# EAGLE design sample-holder-pcb (EAGLE 9.5.2)
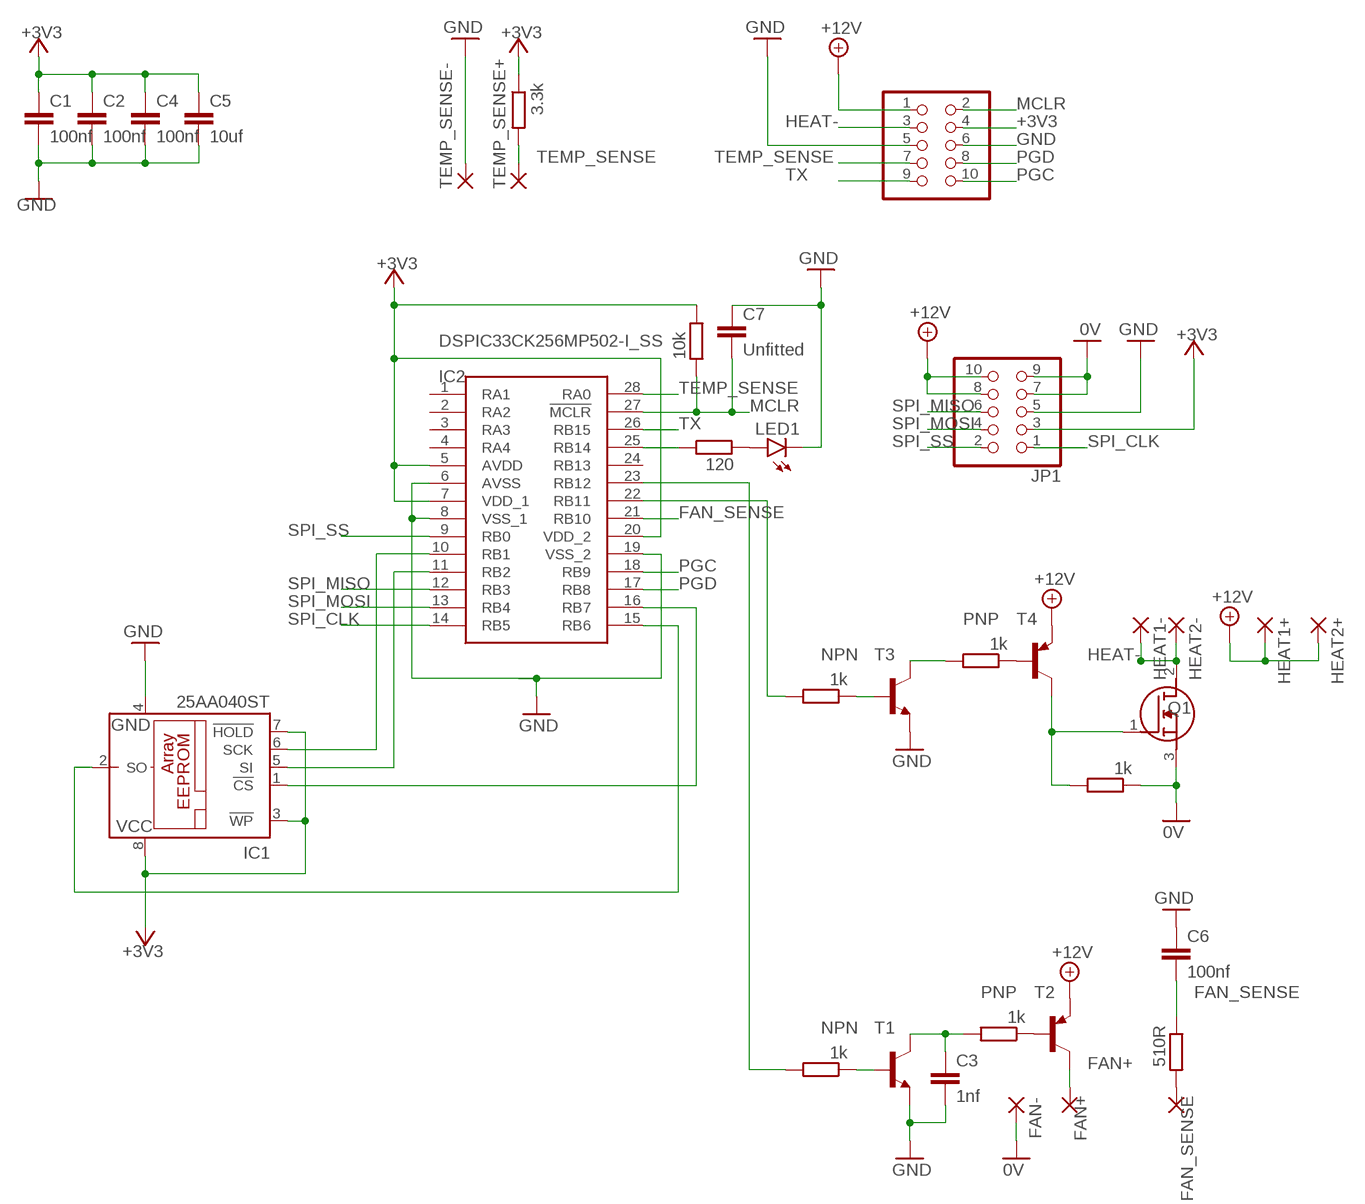
[diagram p0: schematic, sheet 1]

## Parts
C1  100nf  C-EUC0603  [C0603]
C2  100nf  C-EUC0603  [C0603]
C3  1nf  C-EUC0603  [C0603]
C4  100nf  C-EUC0603  [C0603]
C5  10uf  C-EUC1206  [C1206]
C6  100nf  C-EUC0603  [C0603]
C7  Unfitted  C-EUC0603  [C0603]
FAN+  1,6/0,8  [1,6/0,8]
FAN-  1,6/0,8  [1,6/0,8]
FAN_SENSE  1,6/0,8  [1,6/0,8]
HEAT1+  2,54/1,0  [2,54/1,0]
HEAT1-  2,54/1,0  [2,54/1,0]
HEAT2+  2,54/1,0  [2,54/1,0]
HEAT2-  2,54/1,0  [2,54/1,0]
IC1  25AA040ST  [TSSOP8]
IC2  DSPIC33CK256MP502-I_SS  [SOP65P780X200-28N]
JP1  PINHD-2X5/90  [2X05/90]
JP2  PINHD-2X5/90  [2X05/90]
LED1  LEDSML0603  [SML0603]
Q1  AUIRFU8403  [TO229P239X654X978-3P]
R1  1k  R-EU_R0603  [R0603]
R2  1k  R-EU_R0603  [R0603]
R3  1k  R-EU_R0603  [R0603]
R4  1k  R-EU_R0603  [R0603]
R5  1k  R-EU_R0603  [R0603]
R6  510R  R-EU_R0603  [R0603]
R7  3.3k  R-EU_R0603  [R0603]
R8  120  R-EU_R0603  [R0603]
R9  10k  R-EU_R0603  [R0603]
T1  NPN  MMBT3904LT1-NPN-SOT23-BEC  [SOT23-BEC]
T2  PNP  MMBT3906LT1-PNP-SOT23-BEC  [SOT23-BEC]
T3  NPN  MMBT3904LT1-NPN-SOT23-BEC  [SOT23-BEC]
T4  PNP  MMBT3906LT1-PNP-SOT23-BEC  [SOT23-BEC]
TEMP_SENSE+  1,6/0,8  [1,6/0,8]
TEMP_SENSE-  1,6/0,8  [1,6/0,8]

## Nets
0V: FAN-.1(P) JP1.7 JP1.9 Q1.3(S) R5.1
+3V3: C1.1 C2.1 C4.1 C5.1 IC1.3(!WP) IC1.7(!HOLD) IC1.8(VCC) IC2.5(AVDD) IC2.7(VDD_1) IC2.20(VDD_2) JP1.3 JP2.4 R7.1 R9.1
+12V: HEAT1+.1(P) HEAT2+.1(P) JP1.8 JP1.10 JP2.1 T2.E T4.E
FAN+: FAN+.1(P) T2.C
FAN_SENSE: C6.2 IC2.21(RB10) R6.1
GND: C1.2 C2.2 C3.2 C4.2 C5.2 C6.1 C7.1 IC1.4(GND) IC2.6(AVSS) IC2.8(VSS_1) IC2.19(VSS_2) JP1.5 JP2.5 JP2.6 LED1.C T1.E T3.E TEMP_SENSE-.1(P)
HEAT-: HEAT1-.1(P) HEAT2-.1(P) JP2.3 Q1.2(D)
MCLR: C7.2 IC2.27(!MCLR) JP2.2 R9.2
N$1: R2.1 T3.B
N$2: R4.2 T3.C
N$3: R4.1 T4.B
N$4: Q1.1(G) R5.2 T4.C
N$5: FAN_SENSE.1(P) R6.2
N$6: LED1.A R8.2
N$7: IC2.25(RB14) R8.1
N$9: R1.1 T1.B
N$10: C3.1 R3.2 T1.C
N$11: R3.1 T2.B
N$12: IC2.22(RB11) R2.2
N$13: IC1.5(SI) IC2.11(RB2)
N$14: IC1.6(SCK) IC2.10(RB1)
N$15: IC1.2(SO) IC2.15(RB6)
N$16: IC1.1(!CS) IC2.16(RB7)
N$17: IC2.23(RB12) R1.2
PGC: IC2.18(RB9) JP2.10
PGD: IC2.17(RB8) JP2.8
SPI_CLK: IC2.14(RB5) JP1.1
SPI_MISO: IC2.12(RB3) JP1.6
SPI_MOSI: IC2.13(RB4) JP1.4
SPI_SS: IC2.9(RB0) JP1.2
TEMP_SENSE: IC2.28(RA0) JP2.7 R7.2 TEMP_SENSE+.1(P)
TX: IC2.26(RB15) JP2.9
Unconnected: IC2.1(RA1) IC2.2(RA2) IC2.3(RA3) IC2.4(RA4) IC2.24(RB13)

## Library data of the parts
C1-C7 = rcl:C-EU: CAPACITOR, European symbol; SPICEPREFIX: C
FAN+ FAN- FAN_SENSE TEMP_SENSE+ TEMP_SENSE- = wirepad:1,6/0,8: THROUGH-HOLE PAD
HEAT1+ HEAT1- HEAT2+ HEAT2- = wirepad:2,54/1,0: THROUGH-HOLE PAD
IC1 = microchip:25*: Serial EEPROM 4K/ 8K , SPI bus; MPN: 25AA040A-I/MS; OC_FARNELL: 1331345; OC_NEWARK: 35M0801
IC2 = dsPIC33CK256MP502-I_SS:DSPIC33CK256MP502-I_SS: Digital Signal Processors & Controllers - DSP, DSC 16 Bit DSC, 256KB Flash, 24KB RAM, 100MHz, 28Pin, 3 OpAmp, 3 Comp, PTG, CAN-FD Source: Datasheet <http://uk.rs-online.com/web/p/products/1793987P>; DESCRIPTION: Digital Signal Processors & Controllers - DSP, DSC 16 Bit DSC, 256KB Flash, 24KB RAM, 100MHz, 28Pin, 3 OpAmp, 3 Comp, PTG, CAN-FD; HEIGHT: 2mm; MANUFACTURER_NAME: Microchip; MANUFACTURER_PART_NUMBER: dsPIC33CK256MP502-I/SS; RS_PART_NUMBER: 1793987P; RS_PRICE-STOCK: http://uk.rs-online.com/web/p/products/1793987P
JP1 JP2 = pinhead:PINHD-2X5: PIN HEADER
LED1 = led:LED: LED OSRAM: - CHIPLED LG R971, LG N971, LY N971, LG Q971, LY Q971, LO R971, LY R971 LH N974, LH R974 LS Q976, LO Q976, LY Q976 LO Q996 - Hyper CHIPLED LW Q18S LB Q993, LB Q99A, LB R99A - SideLED LS A670, LO A670, LY A670, LG A670, LP A670 LB A673, LV A673, LT A673, LW A673 LH A674 LY A675 LS A676, LA A676, LO A676, LY A676, LW A676 LS A679, LY A679, LG A679 - Hyper Micro SIDELED® LS Y876, LA Y876, LO Y876, LY Y876 LT Y87S - SmartLED LW L88C, LW L88S LB L89C, LB L89S, LG L890 LS L89K, LO L89K, LY L89K LS L896, LA L896, LO L896, LY L896 - TOPLED LS T670, LO T670, LY T670, LG T670, LP T670 LSG T670, LSP T670, LSY T670, LOP T670, LYG T670 LG T671, LOG T671, LSG T671 LB T673, LV T673, LT T673, LW T673 LH T674 LS T676, LA T676, LO T676, LY T676, LB T676, LH T676, LSB T676, LW T676 LB T67C, LV T67C, LT T67C, LS T67K, LO T67K, LY T67K, LW E67C LS E67B, LA E67B, LO E67B, LY E67B, LB E67C, LV E67C, LT E67C LW T67C LS T679, LY T679, LG T679 LS T770, LO T770, LY T770, LG T770, LP T770 LB T773, LV T773, LT T773, LW T773 LH T774 LS E675, LA E675, LY E675, LS T675 LS T776, LA T776, LO T776, LY T776, LB T776 LHGB T686 LT T68C, LB T68C - Hyper Mini TOPLED® LB M676 - Mini TOPLED Santana® LG M470 LS M47K, LO M47K, LY M47K Source: http://www.osram.convergy.de LUXEON: - LUMILED® LXK2-PW12-R00, LXK2-PW12-S00, LXK2-PW14-U00, LXK2-PW14-V00 LXK2-PM12-R00, LXK2-PM12-S00, LXK2-PM14-U00 LXK2-PE12-Q00, LXK2-PE12-R00, LXK2-PE12-S00, LXK2-PE14-T00, LXK2-PE14-U00 LXK2-PB12-K00, LXK2-PB12-L00, LXK2-PB12-M00, LXK2-PB14-N00, LXK2-PB14-P00, LXK2-PB14-Q00 LXK2-PR12-L00, LXK2-PR12-M00, LXK2-PR14-Q00, LXK2-PR14-R00 LXK2-PD12-Q00, LXK2-PD12-R00, LXK2-PD12-S00 LXK2-PH12-R00, LXK2-PH12-S00 LXK2-PL12-P00, LXK2-PL12-Q00, LXK2-PL12-R00 Source: www.luxeon.com KINGBRIGHT: KA-3528ASYC Source: www.kingbright.com
Q1 = AUIRFU8403:AUIRFU8403: Infineon AUIRFU8403 N-channel MOSFET, 100 A, 127 A, 40 V COOLiRFET, 3-Pin IPAK Source: Datasheet <http://uk.rs-online.com/web/p/products/7870991P>; DESCRIPTION: Infineon AUIRFU8403 N-channel MOSFET, 100 A, 127 A, 40 V COOLiRFET, 3-Pin IPAK; HEIGHT: 2.39mm; MANUFACTURER_NAME: Infineon; MANUFACTURER_PART_NUMBER: AUIRFU8403
R1-R9 = rcl:R-EU_: RESISTOR, European symbol; SPICEPREFIX: R
T1 T3 = transistor:*-NPN-: NPN Transistror BF959 corrected 2008.03.06
T2 T4 = transistor:*-PNP-: PNP Transistror

## Board
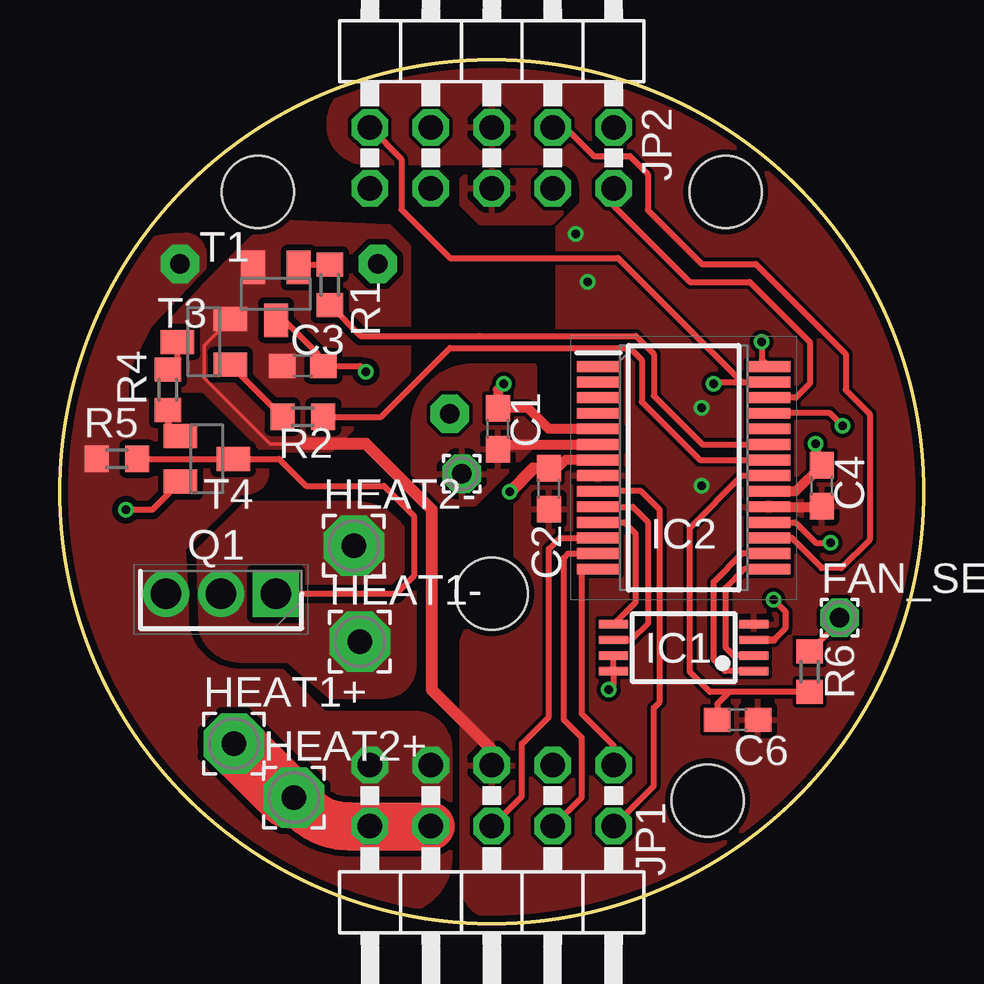
[diagram p1: board, top side]
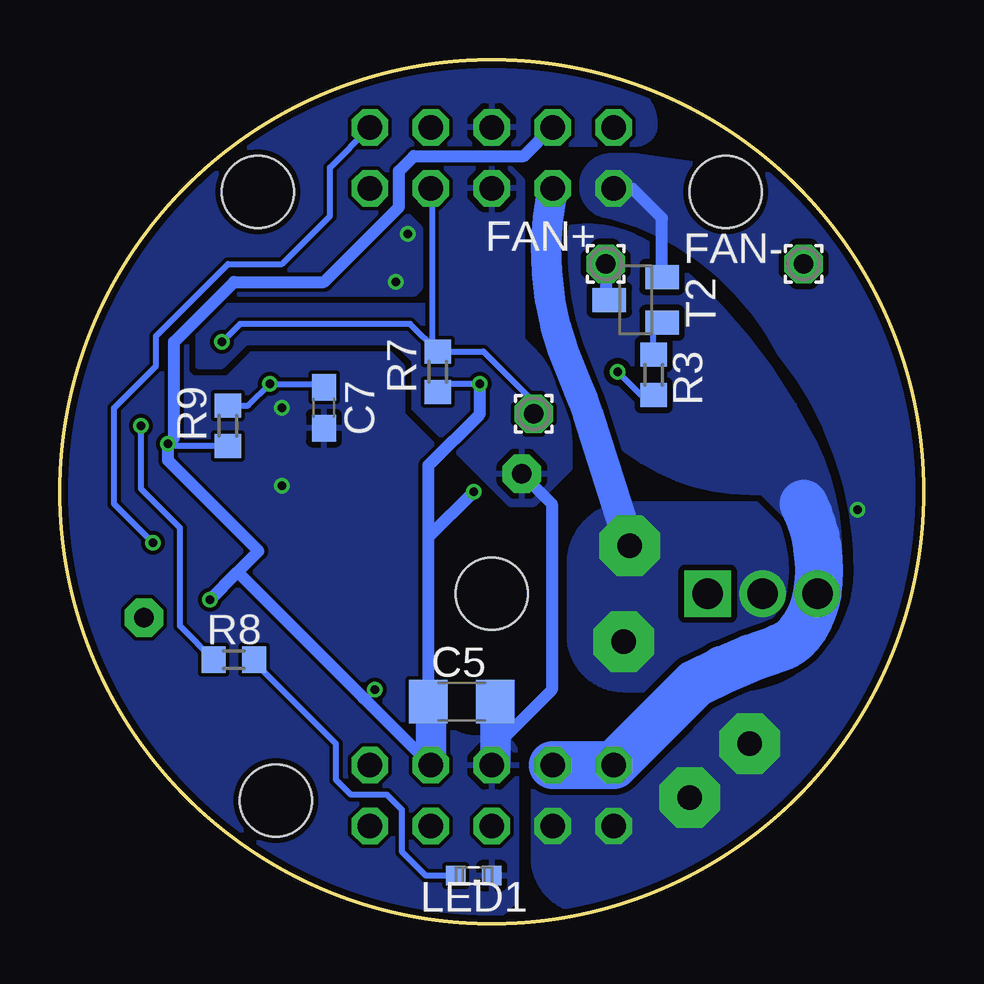
[diagram p2: board, bottom side, seen from below]

Size 36 x 36 mm. Coordinates in mm from the lower left corner, seen from the top.
Outline: circle at 18,18 radius 18
Copper layers (1*16): Top 0.035mm / dielectric 1.5mm / Bottom 0.035mm
Design rules "ITEADstudio_DRC": minimum track width 6mil, minimum drill 12mil, track to track 6mil, track to pad 6mil, pad to pad 6mil, via to via 6mil, smd to smd 0mil, copper to edge 10mil, drill to drill 10mil, minimum pad ring 10mil, minimum via ring 6mil, stop-mask expansion 2mil, vias tented up to drill 100mil, thermal gap 10mil
Holes 3 mm at 18,13.75 8.25,30.5 27.75,30.5 27,5.12

### Footprints (pad centres in the part's own frame; a part is rotated, then mirrored left to right if it is on the bottom)
C0603 = smd 1.1 x 1: 1 -0.85,0; 2 0.85,0
C1206 = smd 1.6 x 1.8: 1 -1.4,0; 2 1.4,0
1,6/0,8 = drill 0.813 pad 1.6 octagon: 1 0,0
2,54/1,0 = drill 1.016 pad 2.54 octagon: 1 0,0
TSSOP8 = smd 0.35 x 1.2: 1 -0.975,-2.925; 2 -0.325,-2.925; 3 0.325,-2.925; 4 0.975,-2.925; 5 0.975,2.925; 6 0.325,2.925; 7 -0.325,2.925; 8 -0.975,2.925
SOP65P780X200-28N = smd 1.8 x 0.45: 1 -3.55,4.225; 2 -3.55,3.575; 3 -3.55,2.925; 4 -3.55,2.275; 5 -3.55,1.625; 6 -3.55,0.975; 7 -3.55,0.325; 8 -3.55,-0.325; 9 -3.55,-0.975; 10 -3.55,-1.625; 11 -3.55,-2.275; 12 -3.55,-2.925; 13 -3.55,-3.575; 14 -3.55,-4.225; 15 3.55,-4.225; 16 3.55,-3.575; 17 3.55,-2.925; 18 3.55,-2.275; 19 3.55,-1.625; 20 3.55,-0.975; 21 3.55,-0.325; 22 3.55,0.325; 23 3.55,0.975; 24 3.55,1.625; 25 3.55,2.275; 26 3.55,2.925; 27 3.55,3.575; 28 3.55,4.225
2X05/90 = drill 1.016 octagon: 1 -5.08,-6.35; 2 -5.08,-3.81; 3 -2.54,-6.35; 4 -2.54,-3.81; 5 0,-6.35; 6 0,-3.81; 7 2.54,-6.35; 8 2.54,-3.81; 9 5.08,-6.35; 10 5.08,-3.81
SML0603 = smd 0.8 x 0.8: A 0.75,0; C -0.75,0
TO229P239X654X978-3P = drill 1.28 pad 1.92 square: 1 0,0 | drill 1.28 pad 1.92: 2 2.29,0; 3 4.58,0
R0603 = smd 1 x 1.1: 1 -0.85,0; 2 0.85,0
SOT23-BEC = smd 1 x 1.4: B -0.95,-1.1; C 0,1.1; E 0.95,-1.1

### Placement (x,y rotation side)
C1  18.25,20.62 270 top
C2  20.38,18.12 270 top
C3  10.12,23.25 180 top
C4  31.75,18.25 270 top
C5  19.25,9.25 0 bottom
C6  28.25,8.5 180 top
C7  25,21.5 90 bottom
FAN+  13.25,27.5 0 bottom
FAN-  5,27.5 0 bottom
FAN_SENSE  32.5,12.75 0 top
HEAT1+  7.25,7.5 0 top
HEAT1-  12.5,11.75 0 top
HEAT2+  9.75,5.25 0 top
HEAT2-  12.25,15.75 0 top
IC1  26,11.5 90 top
IC2  26,19 0 top
JP1  18,0.25 180 top
JP2  18,37 0 top
LED1  18.75,2 180 bottom
Q1  9,13.75 180 top
R1  11.25,26.62 270 top
R2  10.12,21.12 0 top
R3  11.25,22.88 270 bottom
R4  4.5,22.25 90 top
R5  2.38,19.38 0 top
R6  31.25,10.5 90 top
R7  20.25,23 90 bottom
R8  28.75,11 0 bottom
R9  29,20.75 90 bottom
T1  9,26.25 180 top
T2  12,26 90 bottom
T3  6,24.25 90 top
T4  6.12,19.38 270 top
TEMP_SENSE+  16.25,21.25 0 bottom
TEMP_SENSE-  16.75,18.75 0 top

### Tracks (layer width: path | path; a pad name or v marks a point on that pad's centre or on a via)
0V
  Bottom 2: JP1.7 JP1.9 9.51,10.01 arc10 6,11.5 arc-32 5.25,12 | 5,17.5 arc32 4.38,14.25 Q1.3 arc30 5.25,12 | 5.25,12 arc-7 4.88,12.5
  pour Top (isolate 0.254, no thermals): 5.25,12.75 5.25,13.5 arc90 3,15.75 arc90 0.88,13.62 arc90 14,0.5 arc90 16.25,2.75 16.25,7.25 arc90 14.75,8.75 11,8.75 9.25,10.5 7.5,10.5 arc-90
  pour Top (isolate 0.254, no thermals): 5.13,15.63 7.5,18 7.75,18 arc90 8.62,18.88 5.75,21.75 2.75,21.75 2.75,23 3.75,25 6,27.38 6,27.88 arc90 5.19,28.69 arc90 0,23.5 0,14.25 0.75,12.75 4.25,12.75 arc74 5.25,13.5
  pour Bottom (isolate 0.254): 15.06,28.94 arc-90 15.75,28.25 15.75,26.5 arc-90 7.25,18 6.75,18 4.25,15.5 3.5,15.5 arc-26 4.58,20.1 arc-25 11,28 arc-51
+3V3  (via drill 0.35)
  Top 0.254: IC1.7 IC1.8 23.08,9.95 v22.88,9.75 | 29.75,11.82 30.25,12.32 30.25,13 v29.75,13.5
  Top 0.305: IC1.3 29.75,11.82
  Top 0.406: IC2.7 21.08,19.33 20.73,18.98 C2.1 19.73,18.98 | IC2.5 20.38,20.62 19.5,21.5 18.27,21.5 C1.1 18.25,22.25 v18.5,22.5 | v31.5,20 31.5,19.35 C4.1 30.67,18.02 IC2.20
  Top 0.508: 19.73,18.98 v18.75,18
  Bottom 0.254: v22.88,9.75 23.22,9.41 23.34,9.41 | v18.5,22.5 19.9,22.5 R7.1 | R9.1 31.4,19.9 v31.5,20
  Bottom 0.508: JP1.3 23.34,9.41 28.59,14.66 | v29.75,13.5 28.59,14.66 | 28.59,14.66 27.72,15.53 31.5,19.31 v31.5,20 31.25,20.25 31.25,24.25 28.75,26.75 25,26.75 21.88,29.88 21.88,31.38 21.25,32 16.65,32 JP2.4 | v18.75,18 20.65,16.1 | 20.65,16.1 20.65,19.1 18.5,21.25 v18.5,22.5 | 20.65,16.1 C5.1 20.54,9.14
  Bottom 1.27: 20.54,9.14 JP1.3
+12V  (via drill 0.35)
  Top 0.254: T4.E 3.85,17.25 v2.75,17.25
  Top 2: HEAT2+.1 10.2,4.8 arc45 11.99,4.06 JP1.10 JP1.8
  Top 2.54: HEAT1+.1 9.5,5.25 HEAT2+.1
  Bottom 0.508: T2.E 10.9,29.4 12.15,30.65 JP2.1
  pour Bottom (isolate 0.254, no thermals): 16.25,2.75 16.25,6 arc90 13.25,9 4.75,9 arc90 3.5,7.75 arc90 10.75,0.5 14,0.5 arc90
  pour Bottom (isolate 0.254, no thermals): 4.25,6 arc-90 -0.5,10.75 -0.5,25.5 arc-90 5,31 12,32 13,32 arc-90 14.25,30.75 arc-90 13,29.5 arc47 6.02,23.82 arc39 2.8,14.7 arc90 8,9.5 arc-90 9.5,8 arc-90 7.5,6
FAN+
  Bottom 0.508: T2.C 13.25,26.15 FAN+.1
FAN_SENSE
  Top 0.254: R6.1 27.9,9.65 | C6.2 27.4,9.15 27.9,9.65 | 27.9,9.65 27.1,9.65 26.25,10.5 26.25,16.5 28.42,18.67 IC2.21
GND  (via drill 0.35)
  Top 0.152: 10.25,20 8.75,20 6,22.75 6,24.1 T3.E
  Top 0.406: IC2.6 18.45,19.98 C1.2 | IC2.19 31.73,17.38 C4.2
  Top 0.508: JP1.5 18,7.25 15.5,9.75 15.5,17.25 12.75,20 10.25,20
  Bottom 0.508: TEMP_SENSE-.1 15.5,17.5 15.5,9.75 18,7.25 JP1.5
  Bottom 1.27: JP1.5 17.85,6.75 C5.2
  other vias: 26.75,18.25 26.75,21.5 22,26.75 21.5,28.75
  pour Top (isolate 0.254, no thermals): 8.25,20 6,22.25 3.5,22.25 arc-44 4.67,25.17 arc-3 8.76,29.26 13.69,29.06 14.5,28.25 14.5,23 11.25,19.75 8.45,19.75
  pour Bottom: 21.25,21.5 17.25,17.5 16.25,17.5 14.75,19 14.75,20 arc-90 20.5,25.75 29,25.75 30.25,24.5 30.25,23.25 29.25,23.25 28.25,24.25 22,24.25 21.25,23.5
  pour Top: 19.75,20 17.25,17.5 16,17.5 14.75,18.75 14.75,20.75 arc-90 17.25,23.25 19.75,23.25
  pour Top: 31.25,5.5 34.34,8.59 arc116 15.4,37.39 12.59,35.12 arc74 11.21,33.29 arc90 12.75,31.75 20.75,31.75 arc-90 21.75,30.75 21.75,30 20.75,29 20.75,21.5 21,21.25 23,21.25 arc-90 23.75,20.5 23.75,20 arc-90 23,19.25 20.75,19.25 arc90 19,17.5 19,13.75 arc-90 18,12.75 arc90 16.75,11.5 16.75,1.75 arc90 18.25,0.25 arc44
  pour Bottom: 31.25,5.5 34.34,8.59 arc116 15.4,37.39 12.59,35.12 arc74 11.21,33.29 arc90 12,32.5 20.25,32.5 arc-90 22.25,30.5 21.75,29.75 21,29 21,26.5 21.25,26.25 29.25,26.25 30.75,24.75 30.75,23 30.5,22.75 29,22.75 28,23.75 22.25,23.75 21.75,23.25 21.75,21.25 20.25,19.75 20.25,19.5 arc64 19,17.5 19,17 arc90 20,16 arc-90 20.5,15.5 20.5,9.5 arc-90 18.75,7.75 17.75,7.75 arc90 17,7 17,1.5 arc90 18.25,0.25 arc44
  pour Bottom: 20.75,31.5 17.25,31.5 16.75,31 16.75,24 17,23.75 20,25 20.25,25.25 20.5,26.5 20.5,29.25 21.25,30 21.25,31
  pour Top: 20.88,31.38 17.12,31.38 16.75,31 16.75,30 17.5,29.25 20.5,29.25 21.25,30 21.25,31
HEAT-
  Bottom 0.254: JP2.3 15.5,30.61 15.5,30.5
  Bottom 1.27: HEAT2-.1 14,21.25 arc-7 14.59,22.79 arc35 15.5,30.5
  pour Bottom (isolate 0.254, no thermals): 14.75,12 14.75,15 arc90 12.25,17.5 7,17.5 4.5,15 arc90 9.75,9.75 12.5,9.75 arc90
  pour Top (isolate 0.254, no thermals): 14.75,10.75 14.75,15 arc90 12.25,17.5 7.75,17.5 5.77,15.52 5.88,12.38 arc80 7.5,11 9.5,11 11.25,9.5 13.5,9.5 arc90
MCLR  (via drill 0.35)
  Top 0.254: JP2.2 14.23,31.88 14.23,29.77 16.25,27.75 23.25,27.75 28.42,22.58 | 28.42,22.58 IC2.27 | v27.25,22.5 27.33,22.58 28.42,22.58
  Bottom 0.254: R9.2 28.15,21.6 v27.25,22.5 25.15,22.5 C7.2
N$1
  Top 0.254: R2.1 T3.B
N$2
  Top 0.254: R4.2 4.9,23.5 T3.C
N$3
  Top 0.254: T4.B 4.5,20.85 R4.1
N$4
  Top 0.254: R5.2 T4.C 9.12,19.38 10.25,18.25 13.5,18.25 14.75,17 14.75,14.5 14,13.75 Q1.1
N$5
  Top 0.254: FAN_SENSE.1 32.5,12.6 R6.2
N$6
  Bottom 0.254: LED1.A 20.75,2 21.75,3 21.75,4.75 22.38,5.38 23.88,5.38 24.5,6 24.5,7.5 27.9,10.9 R8.2
N$7  (via drill 0.35)
  Top 0.254: v32.62,20.75 32.1,21.27 IC2.25
  Bottom 0.254: R8.1 31,12.4 31,16.5 32.62,18.12 v32.62,20.75
N$9
  Top 0.254: T1.B 10.07,27.48 R1.1
N$10  (via drill 0.35)
  Top 0.254: T1.C 9.35,25.15 10.75,23.75 10.75,23.48 C3.1 12.5,23.25 v12.75,23
  Bottom 0.254: R3.2 11.77,22.02 v12.75,23
N$11
  Bottom 0.254: R3.1 11.27,24.66 T2.B
N$12
  Top 0.254: R2.2 13.38,21.12 16.25,24 23.75,24 24.25,23.5 24.25,21.75 26.67,19.33 IC2.22
N$13
  Top 0.254: IC1.5 24,13.4 24,16.25 23.52,16.73 IC2.11
N$14
  Top 0.254: IC1.6 23.83,11.82 24.5,12.5 24.5,16.75 23.88,17.38 IC2.10
N$15
  Top 0.254: IC1.2 28.08,11.18 27.75,11.5 27.75,14 28.52,14.77 IC2.15
N$16
  Top 0.254: IC1.1 27.73,10.52 27.25,11 27.25,14.25 28.42,15.43 IC2.16
N$17
  Top 0.254: R1.2 12.52,24.5 17.5,24.5 24,24.5 24.75,23.75 24.75,22 26.77,19.98 IC2.23
PGC  (via drill 0.35)
  Top 0.254: IC2.18 30.65,16.73 31.5,15.88 v32.12,15.88
  Bottom 0.254: v32.12,15.88 33.75,17.5 33.75,21.5 32,23.25 32,24.5 29,27.5 26.75,27.5 24.75,29.5 24.75,31.52 JP2.10
PGD
  Top 0.254: JP2.8 21.06,33.19 22.25,32 23.75,32 24.5,31.25 24.5,29.75 26.75,27.5 29,27.5 32.75,23.75 32.75,22.25 33.75,21.25 33.75,16 32.57,14.82 31.76,14.82 30.51,16.07 IC2.17
SPI_CLK
  Top 0.254: JP1.1 23.08,7.42 21.75,8.75 21.75,14.75 21.77,14.77 IC2.14
SPI_MISO
  Top 0.254: JP1.6 19.25,5.31 19.25,7.5 20.38,8.62 20.38,15.62 20.83,16.07 IC2.12
SPI_MOSI
  Top 0.254: JP1.4 21.75,5.27 21.75,7.75 21,8.5 21,15.25 21.17,15.43 IC2.13
SPI_SS
  Top 0.254: IC2.9 24.23,18.02 25,17.25 25,9.25 24.75,9 24.75,5.73 JP1.2
TEMP_SENSE  (via drill 0.35)
  Top 0.254: v29.25,24.25 29.25,23.52 IC2.28
  Bottom 0.254: R7.2 18.35,23.85 16.25,21.75 TEMP_SENSE+.1 | R7.2 21.4,25 28.5,25 v29.25,24.25 | R7.2 20.5,24.1 20.5,30.61 JP2.7
TX
  Top 0.254: JP2.9 23.08,29.92 26.25,26.75 28.75,26.75 31.25,24.25 31.25,22.51 30.67,21.92 IC2.26